# Altium schematic sheet Motor Driver.SchDoc
size A4; Organization: Altium Limited; Address1: L3, 12a Rodborough Rd; Address2: Frenchs Forest; Address3: NSW; Address4: Australia 2086
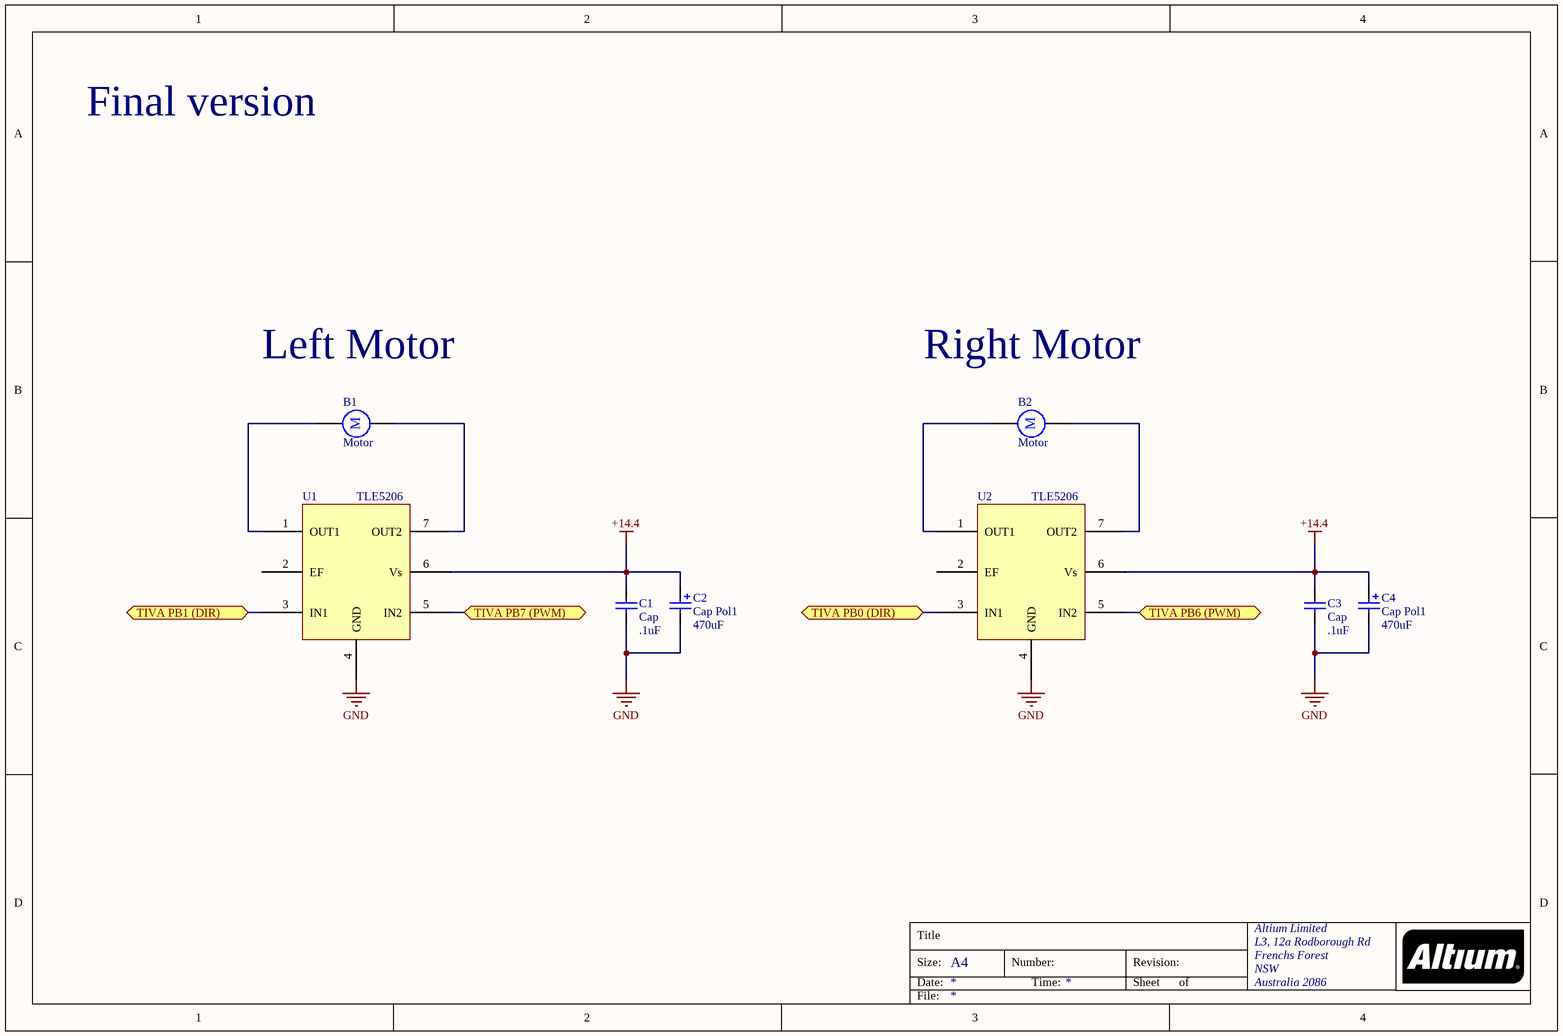
[diagram p0: Motor Driver.SchDoc]

## Parts
B1  Motor  [RB5-10.5]
B2  Motor  [RB5-10.5]
C1  Cap  value .1uF  [RAD-0.3]
C2  Cap Pol1  value 470uF  [RB7.6-15]
C3  Cap  value .1uF  [RAD-0.3]
C4  Cap Pol1  value 470uF  [RB7.6-15]
U1  TLE5206
U2  TLE5206

## Ports
TIVA PB0 (DIR), TIVA PB1 (DIR), TIVA PB6 (PWM), TIVA PB7 (PWM)

## Nets
+14.4: C1.2 C2.1 C3.2 C4.1 U1.6(Vs) U2.6(Vs)
GND: C1.1 C2.2 C3.1 C4.2 U1.4(GND) U2.4(GND)
TIVA PB0 (DIR): U2.3(IN1) ; port TIVA PB0 (DIR)
TIVA PB1 (DIR): U1.3(IN1) ; port TIVA PB1 (DIR)
TIVA PB6 (PWM): U2.5(IN2) ; port TIVA PB6 (PWM)
TIVA PB7 (PWM): U1.5(IN2) ; port TIVA PB7 (PWM)
NetB1_1: B1.1 U1.1(OUT1)
NetB1_2: B1.2 U1.7(OUT2)
NetB2_1: B2.1 U2.1(OUT1)
NetB2_2: B2.2 U2.7(OUT2)

Not connected (* = marked no-connect by the designer): U1 2(EF); U2 2(EF)

## Notes on the sheet
- Final version
- Left Motor
- Right Motor
- Title
- Size:
- Date:
- A4
- Number:
- Time:
- Revision:
- Sheet
- of
- File:
- (in symbol Motor) M

## Library data of the parts
B1 B2 = Motor: Motor, General Kind; Manufacturer: Generic Components; Published: 1999
C1 C3 = Cap: Capacitor; Manufacturer: Generic Components; Class: Passive; Published: 08/06/2000; Publisher: Altium Hobart Technology Centre; SubClass: Capacitor
C2 C4 = Cap Pol1: Polarized Capacitor (Radial); Manufacturer: Generic Components; Class: Passive; Published: 08/06/2000; Publisher: Altium Hobart Technology Centre; SubClass: Capacitor